# Altium schematic sheet Gamepads.SchDoc
size A4; SheetNumber: 10; SheetTotal: 15
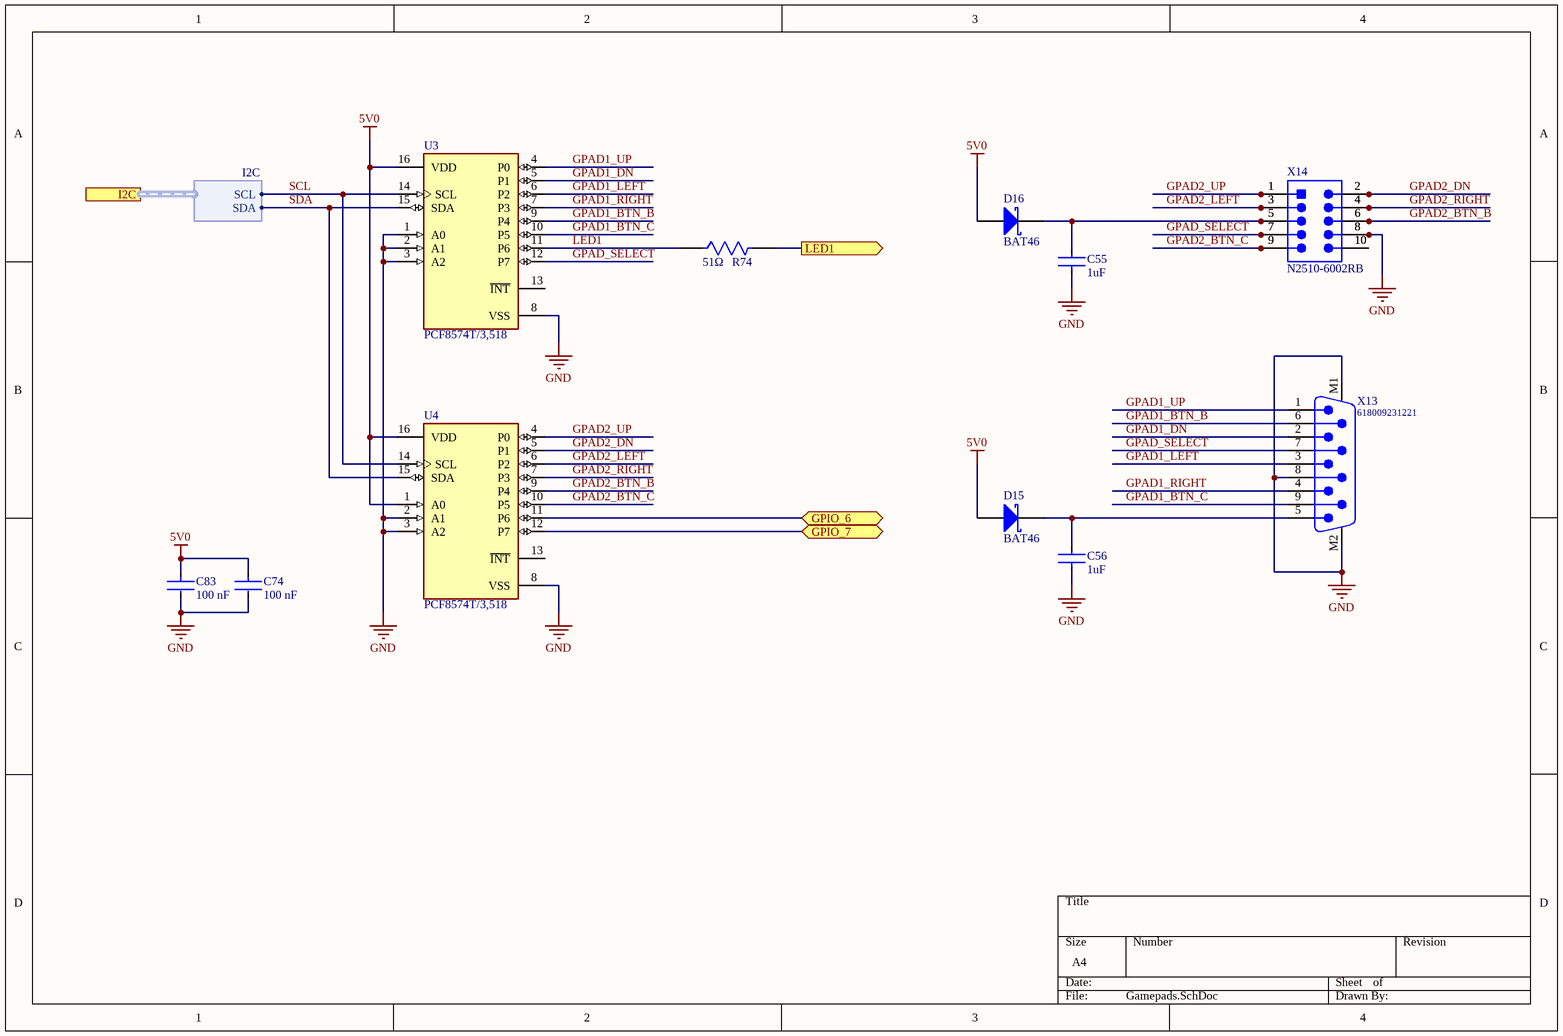
[diagram p0: Gamepads.SchDoc]

## Parts
C55  Capacitance: 1uF  [FP-GCM21B-0_15-IPC_A]  (hidden comment: GCM21BR71E105KA56L)
C56  Capacitance: 1uF  [FP-GCM21B-0_15-IPC_A]  (hidden comment: GCM21BR71E105KA56L)
C74  Capacitance: 100 nF  [FP-CC0805-0_85-IPC_A]  (hidden comment: CC0805KRX7R9BB104)
C83  Capacitance: 100 nF  [FP-CC0805-0_85-IPC_A]  (hidden comment: CC0805KRX7R9BB104)
D15  BAT46  [STM-DO-35-2]
D16  BAT46  [STM-DO-35-2]
R74  Resistance: 51Ω  [FP-RR1220-IPC_A]  (hidden comment: RR1220Q-510-D)
U3  PCF8574T/3,518  [FP-SOT162-1-MFG]
U4  PCF8574T/3,518  [FP-SOT162-1-MFG]
X13  618009231221  [618009231221]
X14  N2510-6002RB  [3M-N2510-6002-10_V]

## Ports
GPIO_6 (bidir), GPIO_7 (bidir), I2C (harness I2C), LED1 (out)

## Harnesses
I2C: SDA, SCL

## Nets
5V0: C74.1 C83.1 D15.1(A) D16.1(A) U3.16(VDD) U4.1(A0) U4.16(VDD)
GND: C55.1 C56.1 C74.2 C83.2 U3.1(A0) U3.2(A1) U3.3(A2) U3.8(VSS) U4.2(A1) U4.3(A2) U4.8(VSS) X13.8 X13.M1 X13.M2 X14.8
GPAD1_BTN_B: U3.9(P4) X13.6
GPAD1_BTN_C: U3.10(P5) X13.9
GPAD1_DN: U3.5(P1) X13.2
GPAD1_LEFT: U3.6(P2) X13.3
GPAD1_RIGHT: U3.7(P3) X13.4
GPAD1_UP: U3.4(P0) X13.1
GPAD2_BTN_B: U4.9(P4) X14.6
GPAD2_BTN_C: U4.10(P5) X14.9
GPAD2_DN: U4.5(P1) X14.2
GPAD2_LEFT: U4.6(P2) X14.3
GPAD2_RIGHT: U4.7(P3) X14.4
GPAD2_UP: U4.4(P0) X14.1
GPAD_SELECT: U3.12(P7) X13.7 X14.7
GPIO_6: U4.11(P6) ; port GPIO_6
GPIO_7: U4.12(P7) ; port GPIO_7
LED1: R74.1 U3.11(P6)
LED1: R74.2 ; port LED1  [a separate net that carries the same name]
SCL: U3.14(SCL) U4.14(SCL) ; port I2C.SCL
SDA: U3.15(SDA) U4.15(SDA) ; port I2C.SDA
NetC55_2: C55.2 D16.2(K) X14.5
NetC56_2: C56.2 D15.2(K) X13.5

Not connected (* = marked no-connect by the designer): U3 13(~{INT}); U4 13(~{INT}); X14 10

## Library data of the parts
C55 C56 = CMP-2007-03346-2: Ceramic Capacitor for Automotive 1uF ±10% 25VDC X7R 0805 Embossed T/R; Manufacturer: Murata; Termination: SMD/SMT; Case/Package: 0805; Manufacturer Part Number: GCM21BR71E105KA56L; value: 1uF; Category: Cap
C74 C83 = CMP-2100-03606-3: CAP CER 0.1UF 50V X7R 0805; Manufacturer: Yageo; Value: 100 nF; Category: Cap; Manufacturer Part Number: CC0805KRX7R9BB104; Case/Package: 0805
D15 D16 = CMP-2000-05926-1: Small Signal Schottky Diode, 150 mA, 100 V, -65 to 125 degC, 2-Pin DO-35, RoHS, Tape and Reel; Manufacturer: STMicroelectronics; Manufacturer Part Number: BAT46; value: BAT46; Category: Diode
R74 = CMP-2001-03561-2: 51Ω ±0.5% 0.1W 1/10W Chip Resistor 0805 (2012 Metric) Thin Film; Manufacturer: Susumu; Case/Package: 0805; Number of Terminations: 2; Termination: SMD/SMT; Number of Pins: 2; Manufacturer Part Number: RR1220Q-510-D; value: 51Ω; Category: Res
U3 U4 = CMP-10112-000010-1: IC I/O EXPANDER I2C 8B 16SOIC; Manufacturer: NXP Semiconductors; Manufacturer Part Number: PCF8574T/3,518; Category: IC; value: PCF8574T/3,518; Case/Package: SOT162-1
X13 = CMP-1502-00284-1: Male PCB Connector with Hex Screw WR-DSUB, 8.08 mm, Angled, 9 pins; Manufacturer: Wurth Electronics; value: DSUB, Angled, 9 pins; Manufacturer Part Number: 618009231221; Case/Package: DSUB-9; Category: Connector
X14 = CMP-2000-06794-1: Male Header, Pitch 2.54 mm, 2 x 5 Postion, Height 9.91 mm, Tail Length 2.84 mm, -55 to 105 degC, RoHS, Bulk; PartNumber: N2510; Manufacturer: 3M; Pitch: 2.54mm; value: 10-Pin Shrouded Header, 2.54mm; Manufacturer Part Number: N2510-6002RB; Case/Package: IDC-10; Category: Connector